# EasyEDA Pro project 2025_08_24_leds.epro

# Schematic Schematic1
Board Name: Board1; Create Date: 2025-08-23; Page Name: P1; Project Name: 2025_08_23_leds; Schematic Name: Schematic1; Update Date: 2025-08-23; Company: EasyEDA.com; Page Size: A4; Version: V1.0
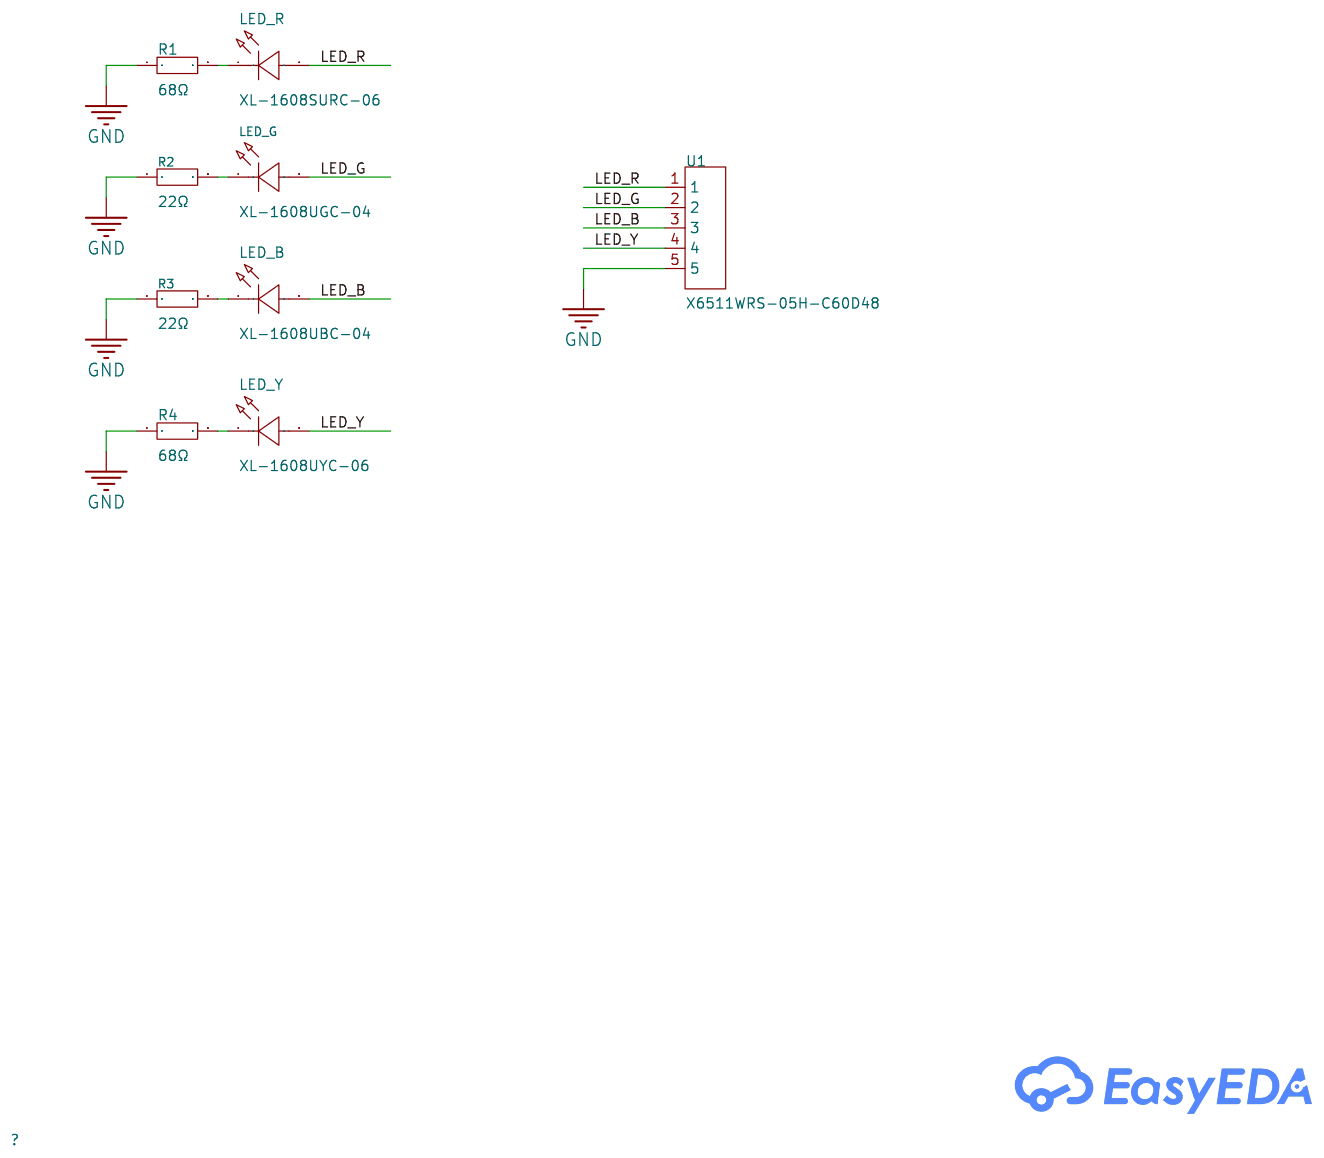
[diagram p0: schematic sheet]

## Parts
LED_B  XL-1608UBC-04  [LED0603-RD_BLUE]
LED_G  XL-1608UGC-04  [LED0603-RD_GREEN]
LED_R  XL-1608SURC-06  [LED0603-RD_RED]
LED_Y  XL-1608UYC-06  [LED0603-RD-YELLOW]
R1  68Ω  [R0402]
R2  22Ω  [R0402]
R3  22Ω  [R0402]
R4  68Ω  [R0402]
U1  X6511WRS-05H-C60D48  [HDR-SMD_5P-P2.54-H-M-W13.3-N]

## Library data of the parts
LED_B = XL-1608UBC-04: Lamp Holder Type:- Illumination Color:Blue Voltage - Forward(Vf):3.3V Voltage - Forward(Vf):3.3V Power(Watts):70mW Forward Current:20mA Wavelength - Dominant:455nm~475nm Wavelength - Dominant:455nm~475nm Peak Wavelength:470nm Diode Configuration:- Lens Co; Supplier Part: C965807; Manufacturer: XINGLIGHT(成兴光); Supplier Footprint: 0603; JLCPCB Part Class: Extended Part; Datasheet: https://item.szlcsc.com/datasheet/XL-1608UBC-04/1051416.html; Supplier: LCSC; Illumination Color: Blue; Voltage - Forward(Vf): 3.3V; Power(Watts): 70mW; Forward Current: 20mA; Wavelength - Dominant: 455nm~475nm; Peak Wavelength: 470nm; Lens Color: Water Clear; Luminous Intensity: 300mcd; Viewing Angle: 120°; Mounting Style: op View Mount
LED_G = XL-1608UGC-04: Lamp Holder Type:- Illumination Color:Emerald Green Voltage - Forward(Vf):3.3V Voltage - Forward(Vf):3.3V Power(Watts):70mW Forward Current:20mA Wavelength - Dominant:515nm~535nm Wavelength - Dominant:515nm~535nm Peak Wavelength:525nm Diode Configuration:; Supplier Part: C965804; Manufacturer: XINGLIGHT(成兴光); Supplier Footprint: 0603; JLCPCB Part Class: Extended Part; Datasheet: https://item.szlcsc.com/datasheet/XL-1608UGC-04/1051413.html; Supplier: LCSC; Illumination Color: Emerald Green; Voltage - Forward(Vf): 3.3V; Power(Watts): 70mW; Forward Current: 20mA; Wavelength - Dominant: 515nm~535nm; Peak Wavelength: 525nm; Diode Configuration: Discrete Diode; Lens Color: Water Clear; Luminous Intensity: 810mcd; Viewing Angle: 120°; Mounting Style: op View Mount
LED_R = XL-1608SURC-06: Lamp Holder Type:- Illumination Color:Red Voltage - Forward(Vf):2.3V Voltage - Forward(Vf):2.3V Power(Watts):50mW Forward Current:20mA Wavelength - Dominant:620nm~630nm Wavelength - Dominant:620nm~630nm Peak Wavelength:625nm Diode Configuration:- Lens Col; Supplier Part: C965799; Manufacturer: XINGLIGHT(成兴光); Supplier Footprint: 0603; JLCPCB Part Class: Extended Part; Datasheet: https://atta.szlcsc.com/upload/public/pdf/source/20250213/F9766CE804AF391355DCDD48DB3E0DAB.pdf; Supplier: LCSC; Illumination Color: Red; Voltage - Forward(Vf): 2.3V; Power(Watts): 50mW; Forward Current: 20mA; Wavelength - Dominant: 620nm~630nm; Peak Wavelength: 625nm; Lens Color: Colorless Transparent Lens; Luminous Intensity: 225mcd; Viewing Angle: 120°; Mounting Sytle: Positive Stick; Operating Temperature: -20℃~+85℃
LED_Y = XL-1608UYC-06: Illumination Color:Yellow Voltage - Forward(Vf):2.4V Voltage - Forward(Vf):2.4V Power(Watts):50mW Forward Current:20mA Wavelength - Dominant:585nm~595nm Wavelength - Dominant:585nm~595nm Peak Wavelength:590nm Lens Color:Water Clear Color Temperature:- Col; Supplier Part: C965802; Manufacturer: XINGLIGHT(成兴光); Supplier Footprint: 0603; JLCPCB Part Class: Extended Part; Datasheet: https://item.szlcsc.com/datasheet/XL-1608UYC-06/1051411.html; Supplier: LCSC; Illumination Color: Yellow; Voltage - Forward(Vf): 2.4V; Power(Watts): 50mW; Forward Current: 20mA; Wavelength - Dominant: 585nm~595nm; Peak Wavelength: 590nm; Lens Color: Water Clear; Luminous Intensity: 435mcd; Viewing Angle: 120°; Mounting Style: op View Mount
R1 R4 = RC0402FR-0768RL: Type:Thick Film Resistor Resistance:68Ω Tolerance:±1% Tolerance:±1% Power(Watts):62.5mW Voltage-Supply(Max):50V Temperature Coefficient:±100ppm/℃ Temperature Coefficient:±100ppm/℃ Operating Temperature:-55℃~+155℃ Operating Temperature:-55℃~+155℃; LCSC Part Name: 厚膜电阻 68Ω ±1% 62.5mW; Supplier Part: C163455; Manufacturer: YAGEO(国巨); Supplier Footprint: 0402; JLCPCB Part Class: Extended Part; Datasheet: https://item.szlcsc.com/datasheet/RC0402FR-0768RL/174836.html; Supplier: LCSC; Type: Thick Film Resistor; Tolerance: ±1%; Power(Watts): 62.5mW; Voltage-Supply(Max): 50V; Temperature Coefficient: ±100ppm/℃; Operating Temperature: -55℃~+155℃
R2 R3 = 0402WGF220JTCE: Type:Thick Film Resistors Resistance:22Ω Tolerance:±1% Tolerance:±1% Power(Watts): Overload Voltage (Max): Temperature Coefficient:±100ppm/℃ Temperature Coefficient:±100ppm/℃ Operating Temperature Range:-55℃~+155℃ Operating Temperature Range:-55℃~+155℃; LCSC Part Name: 22Ω ±1% 62.5mW 厚膜电阻; Supplier Part: C25092; Manufacturer: UNI-ROYAL(厚声); Supplier Footprint: 0402; JLCPCB Part Class: Basic Part; Datasheet: https://atta.szlcsc.com/upload/public/pdf/source/20200306/C422600_1E6D84923E4A46A82E41ADD87F860B5C.pdf; Supplier: LCSC; Type: Thick Film Resistors; Tolerance: ±1%; Temperature Coefficient: ±100ppm/℃; Operating Temperature Range: -55℃~+155℃
U1 = X6511WRS-05H-C60D48: Pin Structure:1x5P Pitch:2.54mm Row Spacing:2.54mm Circluar Pins/Square Pins:Pin Header Number of Rows:1 Number of Pins:5P Current Rating:3A Voltage Rating (Max):250V Length of Mating Pin:- Insulation Height:2.5mm Length of End Connection Pin:- Contact Ma; LCSC Part Name: 1x5P 间距:2.54mm 方针; Supplier Part: C5242198; Manufacturer: XKB Connection(中国星坤); Supplier Footprint: SMD,P=2.54mm,卧贴; JLCPCB Part Class: Extended Part; Datasheet: https://item.szlcsc.com/datasheet/X6511WRS-05H-C60D48/5950305.html; Supplier: LCSC; Pin Structure: 1x5P; Pitch: 2.54mm; Row Spacing: 2.54mm; Circluar Pins/Square Pins: Pin Header; Number of Rows: 1; Number of Pins: 5P; Current Rating: 3A; Voltage Rating (Max): 250V; Insulation Height: 2.5mm; Contact Material: Brass; Contact Plating: Gold; Operating Temperature: -40℃~+105℃; Color: Black

## Nets
GND: R1.1 R2.1 R3.1 R4.1 U1.5
LED_B: LED_B.2(A) U1.3
LED_G: LED_G.2(A) U1.2
LED_R: LED_R.2(A) U1.1
LED_Y: LED_Y.2(A) U1.4
$1N337: LED_R.1(K) R1.2
$1N338: LED_G.1(K) R2.2
$1N342: LED_B.1(K) R3.2
$1N531: LED_Y.1(K) R4.2

# Board PCB1
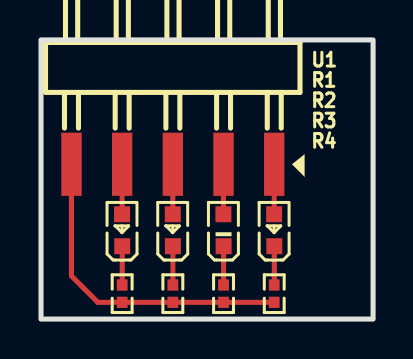
[diagram p1: board, top side]
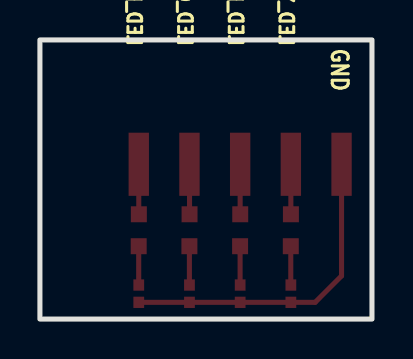
[diagram p2: board, bottom side, seen from below]

Outline 16.64 x 13.97 mm; copper layers: Top Layer, Bottom Layer. Coordinates in mm from the lower left corner of the outline.
Outline path: rectangle 0,13.97 16.64,0
Stack: Top Layer 0.035mm / Dielectric1 1.51mm FR4 er 4.5 / Bottom Layer 0.035mm

## Design rules (mm)
template: JLCPCB Capability(Two Layers Board)
spacing copperThickness1oz (default): track to track 0.102, other pairs 0.152 to 0.3
spacing copperThickness2oz: track to track 0.203, other pairs 0.152 to 0.3
track width copperThickness1oz (default): min 0.127, default 0.254, max 2.54
track width copperThickness2oz: min 0.203, default 0.254, max 2.54
differential pair differentialPair (default): width min 0.127, default 0.254, max 2.54; gap min 0.152, default 0.152
via viaSize (default): diameter min 0.5, default 0.61, max 10; hole min 0.3, default 0.305, max 6.3

## Placement (name value [footprint] x y rotation side)
LED_B  XL-1608UBC-04  [LED0603-RD_BLUE]  6.6 4.44 90 top
LED_G  XL-1608UGC-04  [LED0603-RD_GREEN]  9.14 4.44 90 top
LED_R  XL-1608SURC-06  [LED0603-RD_RED]  11.68 4.44 90 top
LED_Y  XL-1608UYC-06  [LED0603-RD-YELLOW]  4.06 4.44 90 top
R1  68Ω  [R0402]  11.68 1.27 90 top
R2  22Ω  [R0402]  9.14 1.27 90 top
R3  22Ω  [R0402]  6.6 1.27 90 top
R4  68Ω  [R0402]  4.06 1.27 90 top
U1  X6511WRS-05H-C60D48  [HDR-SMD_5P-P2.54-H-M-W13.3-N]  6.6 7.75 180 top

## Footprints (pads in the part's own frame, mm; a bottom-side part is the same pattern mirrored in y, then rotated)
HDR-SMD_5P-P2.54-H-M-W13.3-N
  rect 1.02x3.16 smd: 1(-5.08,0) 2(-2.54,0) 3(0,0) 4(2.54,0) 5(5.08,0)
LED0603-RD-YELLOW
  rect 0.8x0.8 smd: 1(-0.799,-0.004) 2(0.799,0.004)
LED0603-RD_BLUE
  rect 0.8x0.8 smd: 1(-0.799,-0.004) 2(0.799,0.004)
LED0603-RD_GREEN
  rect 0.8x0.8 smd: 1(-0.799,-0.004) 2(0.799,0.004)
LED0603-RD_RED
  rect 0.8x0.8 smd: 1(-0.799,-0.004) 2(0.799,0.004)
R0402
  rect 0.566x0.54 smd: 1(-0.433,0) 2(0.433,0)

## Nets
As in the schematic.

## Routing (per net, layer and track width the routed paths; a pad name or vN(x,y) marks a point on that pad's centre or on a via; arc(x,y) is an arc through that point)
GND: length 16.3
  Top Layer w0.254: 11.68,0.84 2.85,0.84 1.52,2.16 U1.5
LED_B: length 2.5
  Top Layer w0.254: LED_B.2 6.6,5.25 U1.3
LED_G: length 2.5
  Top Layer w0.254: LED_G.2 9.14,7.74 U1.2
LED_R: length 2.5
  Top Layer w0.254: U1.1 11.68,5.25 LED_R.2
LED_Y: length 2.5
  Top Layer w0.254: U1.4 4.06,5.25 LED_Y.2
$1N337: length 1.9
  Top Layer w0.254: R1.2 11.69,1.71 LED_R.1
$1N338: length 1.9
  Top Layer w0.254: LED_G.1 9.15,1.71 R2.2
$1N342: length 1.9
  Top Layer w0.254: R3.2 6.61,1.71 LED_B.1
$1N531: length 1.9
  Top Layer w0.254: R4.2 4.07,1.71 LED_Y.1

## Text on the board
Bottom Silkscreen Layer: GND
